# EAGLE design BlueSensor (EAGLE 6.4)
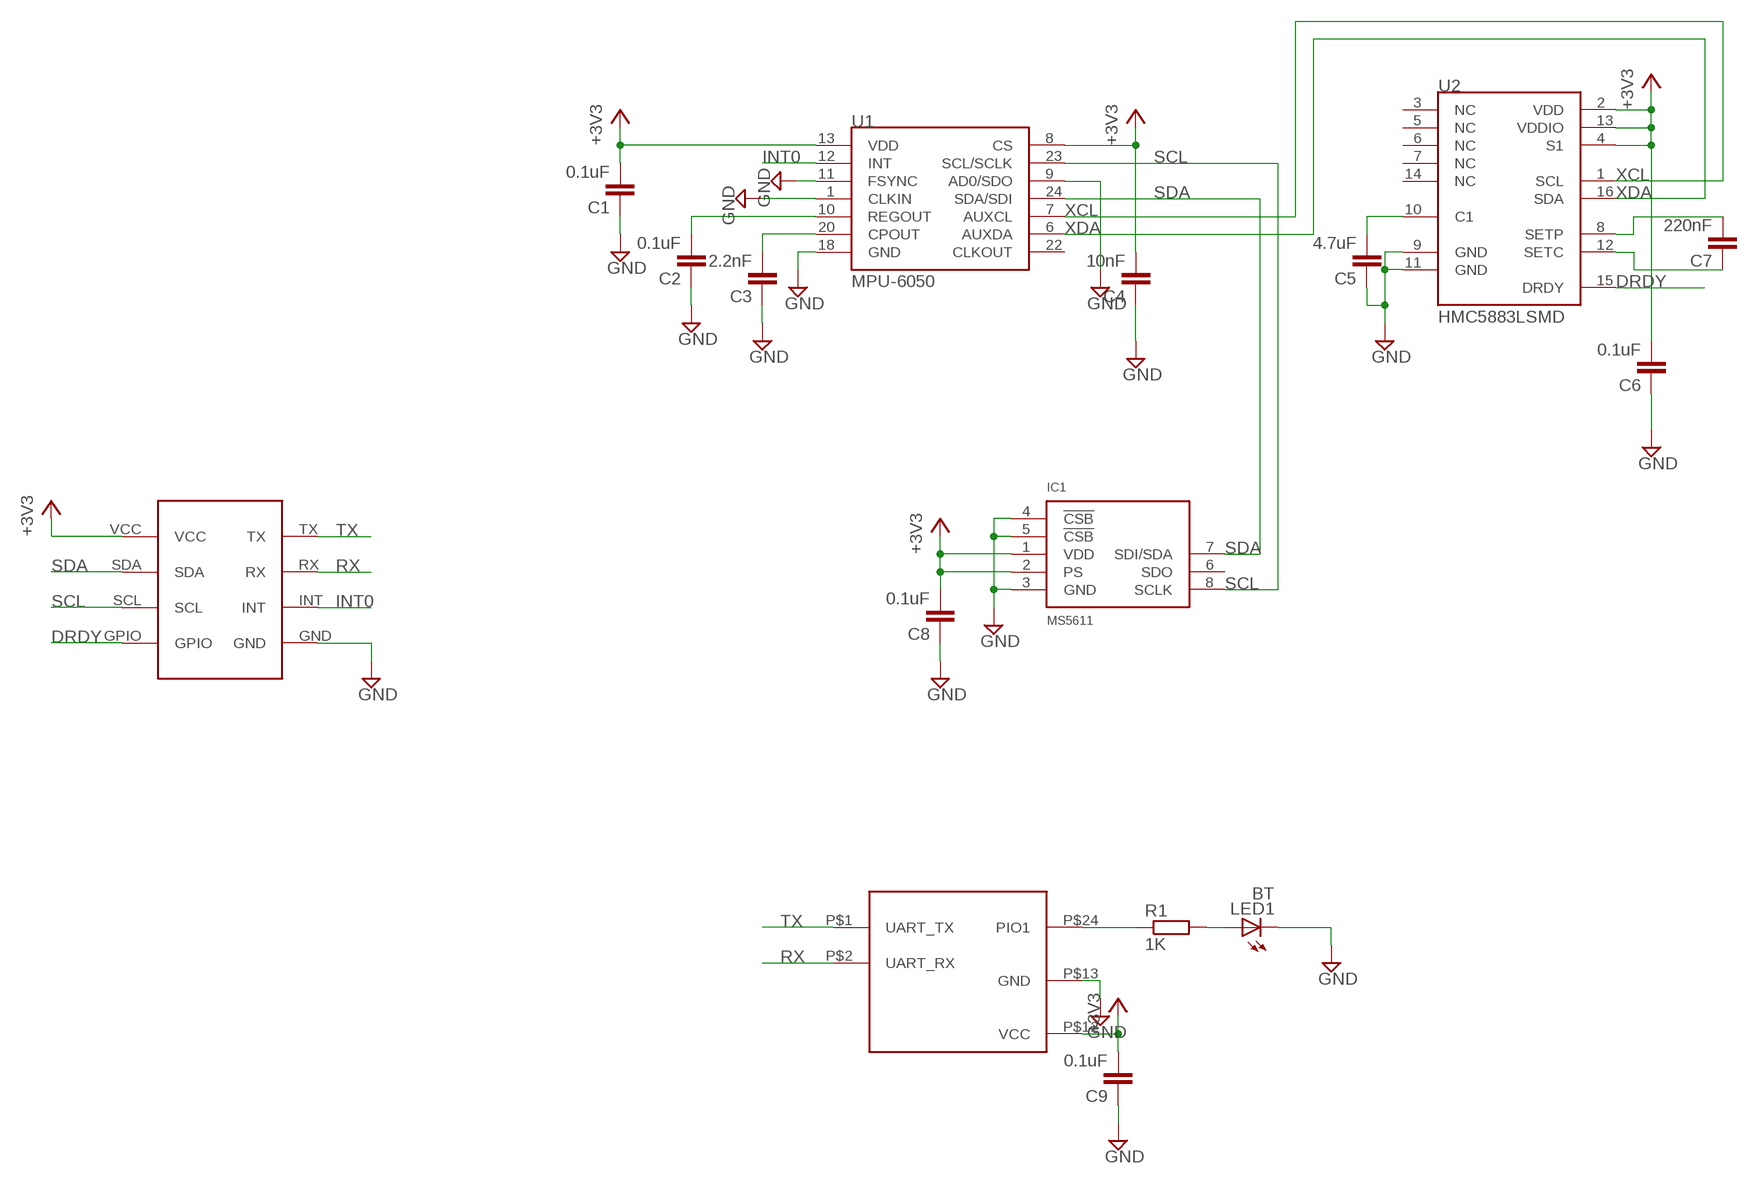
[diagram p0: schematic, sheet 1]

## Parts
C1  0.1uF  C-EUC0805  [C0805]
C2  0.1uF  C-EUC0805  [C0805]
C3  2.2nF  C-EUC0805  [C0805]
C4  10nF  C-EUC0805  [C0805]
C5  4.7uF  C-EUC0805  [C0805]
C6  0.1uF  C-EUC0805  [C0805]
C7  220nF  C-EUC0805  [C0805]
C8  0.1uF  C-EUC0805  [C0805]
C9  0.1uF  C-EUC0805  [C0805]
IC1  MS5611  [QFN-MS5611]
LED1  BT  LEDCHIPLED_0805  [CHIPLED_0805]
R1  1K  R-EU_R0805  [R0805]
U1  MPU-6050  MPU-6000QFN-24  [QFN-24-TESTING]
U2  HMC5883LSMD  [16LPCC]
U$1  BLUESIMPLEHC-07  [HC-07-SIMPLE]
U$2  BLUESENSORBOARD  [BLUESENSOR-BOARD]

## Nets
+3V3: C1.2 C4.2 C6.2 C8.2 C9.2 IC1.1(VDD) IC1.2(PS) U1.8(CS) U1.13(VDD) U2.2(VDD) U2.4(S1) U2.13(VDDIO) U$1.P$12(VCC) U$2.VCC
DRDY: U2.15(DRDY) U$2.GPIO
GND: C1.1 C2.1 C3.1 C4.1 C5.1 C6.1 C8.1 C9.1 IC1.3(GND) IC1.4(!CSB) IC1.5(!CSB) LED1.C U1.1(CLKIN) U1.9(AD0/SDO) U1.11(FSYNC) U1.18(GND) U2.9(GND) U2.11(GND) U$1.P$13(GND) U$2.GND
INT0: U1.12(INT) U$2.INT
N$3: C5.2 U2.10(C1)
N$6: C7.2 U2.8(SETP)
N$7: C7.1 U2.12(SETC)
N$13: R1.1 U$1.P$24(PIO1)
N$15: LED1.A R1.2
N$18: C3.2 U1.20(CPOUT)
N$19: C2.2 U1.10(REGOUT)
RX: U$1.P$2(UART_RX) U$2.RX
SCL: IC1.8(SCLK) U1.23(SCL/SCLK) U$2.SCL
SDA: IC1.7(SDI/SDA) U1.24(SDA/SDI) U$2.SDA
TX: U$1.P$1(UART_TX) U$2.TX
XCL: U1.7(AUXCL) U2.1(SCL)
XDA: U1.6(AUXDA) U2.16(SDA)
Unconnected: IC1.6(SDO) U1.22(CLKOUT) U2.3(NC) U2.5(NC) U2.6(NC) U2.7(NC) U2.14(NC)

## Library data of the parts
C1-C9 = resistor:C-EU: CAPACITOR, European symbol
IC1 = aspirin:MS5611
LED1 = led:LED: LED OSRAM: - CHIPLED LG R971, LG N971, LY N971, LG Q971, LY Q971, LO R971, LY R971 LH N974, LH R974 LS Q976, LO Q976, LY Q976 LO Q996 - Hyper CHIPLED LW Q18S LB Q993, LB Q99A, LB R99A - SideLED LS A670, LO A670, LY A670, LG A670, LP A670 LB A673, LV A673, LT A673, LW A673 LH A674 LY A675 LS A676, LA A676, LO A676, LY A676, LW A676 LS A679, LY A679, LG A679 - Hyper Micro SIDELED® LS Y876, LA Y876, LO Y876, LY Y876 LT Y87S - SmartLED LW L88C, LW L88S LB L89C, LB L89S, LG L890 LS L89K, LO L89K, LY L89K LS L896, LA L896, LO L896, LY L896 - TOPLED LS T670, LO T670, LY T670, LG T670, LP T670 LSG T670, LSP T670, LSY T670, LOP T670, LYG T670 LG T671, LOG T671, LSG T671 LB T673, LV T673, LT T673, LW T673 LH T674 LS T676, LA T676, LO T676, LY T676, LB T676, LH T676, LSB T676, LW T676 LB T67C, LV T67C, LT T67C, LS T67K, LO T67K, LY T67K, LW E67C LS E67B, LA E67B, LO E67B, LY E67B, LB E67C, LV E67C, LT E67C LW T67C LS T679, LY T679, LG T679 LS T770, LO T770, LY T770, LG T770, LP T770 LB T773, LV T773, LT T773, LW T773 LH T774 LS E675, LA E675, LY E675, LS T675 LS T776, LA T776, LO T776, LY T776, LB T776 LHGB T686 LT T68C, LB T68C - Hyper Mini TOPLED® LB M676 - Mini TOPLED Santana® LG M470 LS M47K, LO M47K, LY M47K Source: http://www.osram.convergy.de LUXEON: - LUMILED® LXK2-PW12-R00, LXK2-PW12-S00, LXK2-PW14-U00, LXK2-PW14-V00 LXK2-PM12-R00, LXK2-PM12-S00, LXK2-PM14-U00 LXK2-PE12-Q00, LXK2-PE12-R00, LXK2-PE12-S00, LXK2-PE14-T00, LXK2-PE14-U00 LXK2-PB12-K00, LXK2-PB12-L00, LXK2-PB12-M00, LXK2-PB14-N00, LXK2-PB14-P00, LXK2-PB14-Q00 LXK2-PR12-L00, LXK2-PR12-M00, LXK2-PR14-Q00, LXK2-PR14-R00 LXK2-PD12-Q00, LXK2-PD12-R00, LXK2-PD12-S00 LXK2-PH12-R00, LXK2-PH12-S00 LXK2-PL12-P00, LXK2-PL12-Q00, LXK2-PL12-R00 Source: www.luxeon.com KINGBRIGHT: KA-3528ASYC Source: www.kingbright.com
R1 = resistor:R-EU_: RESISTOR, European symbol
U1 = SparkFun-Sensors:MPU-6000: MPU-6000 - I2C address is 0x68 with AD0 low and 0x69 with AD0 high.
U2 = SparkFun-Sensors:HMC5883L: 3 Axis Digital Compass IC
U$1 = Mini-Q:BLUESIMPLE
U$2 = Mini-Q:BLUESENSOR

## Board
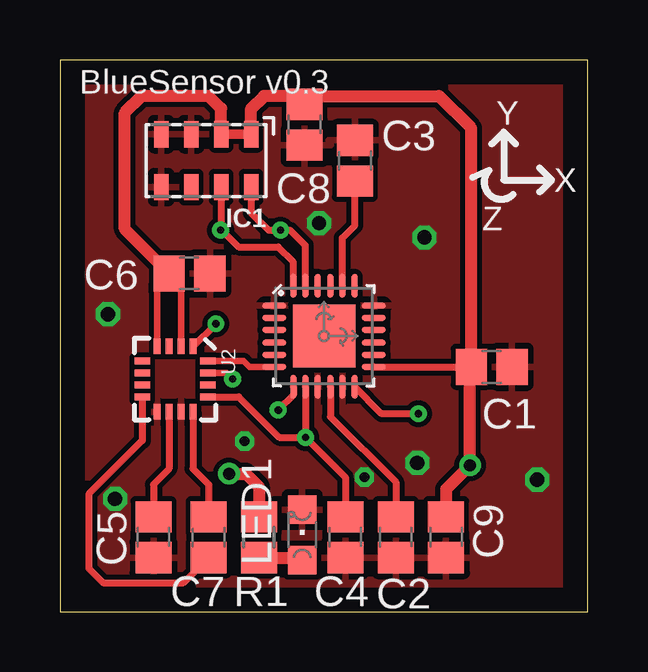
[diagram p1: board, top side]
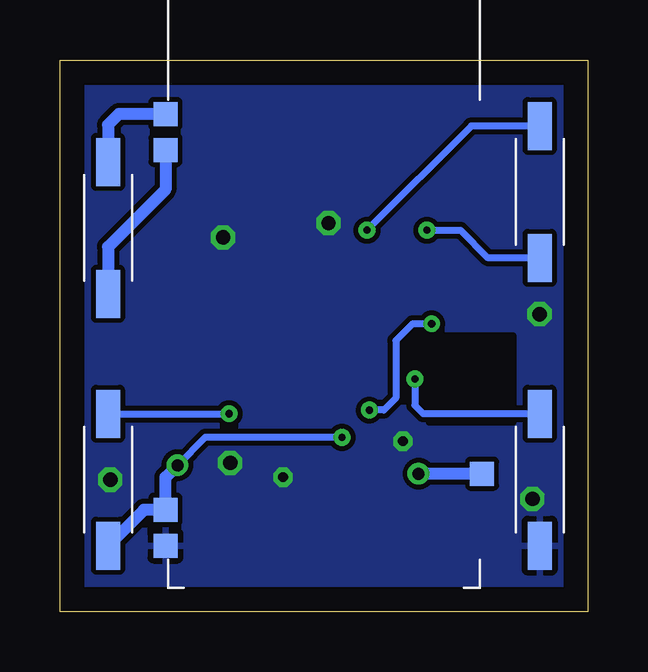
[diagram p2: board, bottom side, seen from below]

Size 22 x 23 mm. Coordinates in mm from the lower left corner, seen from the top.
Outline: 0,0 22,0 22,23 0,23 0,0
Copper layers (1*16): Top 0.035mm / dielectric 1.5mm / Bottom 0.035mm
Design rules "default": minimum track width 10mil, minimum drill 24mil, track to track 8mil, track to pad 8mil, pad to pad 8mil, via to via 8mil, smd to smd 8mil, copper to edge 40mil, drill to drill 8mil, minimum pad ring 10mil, minimum via ring 8mil, stop-mask expansion 4mil, vias tented up to drill 0mil, thermal gap 10mil

### Footprints (pad centres in the part's own frame; a part is rotated, then mirrored left to right if it is on the bottom)
C0805 = smd 1.3 x 1.5: 1 -0.85,0; 2 0.85,0
QFN-MS5611 = smd 1.1 x 0.6: 1 -1.1,1.875; 2 -1.1,0.625; 3 -1.1,-0.625; 4 -1.1,-1.875; 5 1.1,-1.875; 6 1.1,-0.625; 7 1.1,0.625; 8 1.1,1.875
CHIPLED_0805 = smd 1.2 x 1.2: A 0,-1.05; C 0,1.05
R0805 = smd 1.3 x 1.5: 1 -0.85,0; 2 0.85,0
QFN-24-TESTING = smd 1.016 x 0.254: 1 -2.066,1.257; 2 -2.066,0.75; 3 -2.066,0.247; 4 -2.066,-0.287; 5 -2.066,-0.792; 6 -2.066,-1.297; 13 2.086,-1.297; 14 2.086,-0.792; 15 2.086,-0.287; 16 2.086,0.247; 17 2.086,0.75; 18 2.086,1.257 | smd 0.254 x 1.016: 7 -1.267,-2.122; 8 -0.762,-2.122; 9 -0.258,-2.122; 10 0.278,-2.122; 11 0.78,-2.122; 12 1.287,-2.122; 19 1.287,2.082; 20 0.78,2.082; 21 0.278,2.082; 22 -0.258,2.082; 23 -0.762,2.082; 24 -1.267,2.082 | smd 2.616 x 2.616: P$1 0.02,-0.01
16LPCC = smd 0.65 x 0.28: 1 -1.37,0.75; 2 -1.37,0.25; 3 -1.37,-0.25; 4 -1.37,-0.75; 9 1.37,-0.75; 10 1.37,-0.25; 11 1.37,0.25; 12 1.37,0.75 | smd 0.28 x 0.65: 5 -0.75,-1.37; 6 -0.25,-1.37; 7 0.25,-1.37; 8 0.75,-1.37; 13 0.75,1.37; 14 0.25,1.37; 15 -0.25,1.37; 16 -0.75,1.37
HC-07-SIMPLE = smd 1 x 1: P$1 -6.6,19.75; P$2 -6.6,18.25; P$12 -6.6,3.25; P$13 -6.6,1.75; P$24 6.6,4.75
BLUESENSOR-BOARD = smd 1 x 2 bottom: GND -9,-8.75; GPIO -9,-3.25; INT 9,-3.25; RX 9,1.75; SCL -9,8.75; SDA -9,3.25; TX 9,7.25; VCC 9,-8.75

### Placement (x,y rotation side)
C1  18,10.2 180 top
C2  14,3.1 90 top
C3  12.3,18.8 270 top
C4  11.9,3.1 90 top
C5  3.9,3.1 90 top
C6  5.4,14.1 180 top
C7  6.2,3.1 270 top
C8  10.2,20.3 90 top
C9  16.1,3.1 90 top
IC1  6.1,18.8 270 top
LED1  10.1,3.2 0 top
R1  8.3,3.1 270 top
U1  11,11.5 0 top
U2  4.8,9.7 270 top
U$1  11,1 0 bottom
U$2  11,11.5 0 top

### Tracks (layer width: path | path; a pad name or v marks a point on that pad's centre or on a via)
+3V3  (via drill 0.3, 0.5)
  Top 0.28: U2.4 4.05,13.6 | U2.2 5.05,13.6
  Top 0.3: C4.2 11.9,5.6 v10.24,7.26 | 4.05,13.6 C6.2 5.05,13.6 | U2.13 7.45,8.95 9.14,7.26 v10.24,7.26 | U1.13 C1.2 | U1.8 v10.24,7.26
  Top 0.4: IC1.2 IC1.1
  Top 0.5: C9.2 16.1,5.1 v17.1,6.1 17.1,10.15 C1.2 | C6.2 2.7,15.95 2.7,20.8 3.4,21.5 6.2,21.5 6.72,20.98 IC1.2 | C1.2 17.15,20.15 15.8,21.5 9.75,21.5 | IC1.1 7.97,20.98 8.5,21.5 9.75,21.5 | 9.75,21.5 C8.2
  Bottom 0.3: v10.24,7.26 15.94,7.26 v17.1,6.1
  Bottom 0.5: v17.1,6.1 17.6,5.6 U$1.P$12 18.5,4.25 U$2.VCC
DRDY  (via drill 0.3)
  Top 0.28: U2.15 6.95,9.95 v7.2,9.7
  Bottom 0.3: v7.2,9.7 7.2,8.6 6.85,8.25 U$2.GPIO
GND  (via drill 0.4, 0.6)
  other vias: 14.9,6.2 15.2,15.6 12.7,5.6 2,12.4 2.3,4.7 7.7,7.1 10.8,16.2 19.9,5.5
  pour Top (rank 2): 0,23 22,23 22,0 0,0
  pour Bottom (rank 2): 0,23 22,23 22,0 0,0
INT0  (via drill 0.3)
  Top 0.3: v14.95,8.25 13.41,8.25 U1.12
  Bottom 0.3: U$2.INT v14.95,8.25
N$3
  Top 0.3: U2.10 4.55,5.95 3.9,5.3 C5.2
N$4
  cutout Bottom: 3.1,11.5 6.6,11.5 6.6,7.9 3.1,7.9
N$6
  Top 0.3: U2.8 3.43,7.13 1.2,4.9 1.2,1.8 1.8,1.2 5.15,1.2 C7.2
N$7
  Top 0.3: U2.12 5.55,5.95 6.2,5.3 C7.1
N$13  (via drill 0.5)
  Top 0.5: v7.05,5.75 7.75,5.75 8.3,5.2 R1.1
  Bottom 0.5: U$1.P$24 v7.05,5.75
N$15
  Top 0.5: R1.2 10,2.25 LED1.A
N$18
  Top 0.3: U1.20 11.78,15.58 12.3,16.1 C3.2
N$19
  Top 0.3: U1.10 11.28,8.12 14,5.4 C2.2
RX
  Bottom 0.5: U$1.P$2 17.6,17.6 20,15.2 U$2.RX
SCL  (via drill 0.3)
  Top 0.3: U1.23 10.24,15.26 9.6,15.9 v9.2,15.9 8.7,15.9 7.97,16.62 IC1.8
  Bottom 0.3: U$2.SCL 4.85,20.25 v9.2,15.9
SDA  (via drill 0.3)
  Top 0.3: U1.24 9.73,14.57 9.1,15.2 7.45,15.2 6.72,15.93 | IC1.7 6.72,15.93 | 6.72,15.93 v6.7,15.9
  Bottom 0.3: U$2.SDA 4.15,14.75 5.3,15.9 v6.7,15.9
TX
  Bottom 0.5: U$1.P$1 19.55,20.75 20,20.3 U$2.TX
XCL  (via drill 0.3)
  Top 0.3: U2.1 5.57,11.07 v6.5,12 | U1.7 9.73,9.03 v9.1,8.4
  Bottom 0.3: v6.5,12 7.3,12 8,11.3 8,8.9 8.5,8.4 v9.1,8.4
XDA
  Top 0.28: U1.6 7.9,10.2 7.65,10.45 U2.16

### Text on the board
tNames: BlueSensor v0.3 | Y | X | Z